# EAGLE design Corn3 (EAGLE 6.1)

## Sheet 1 of 4
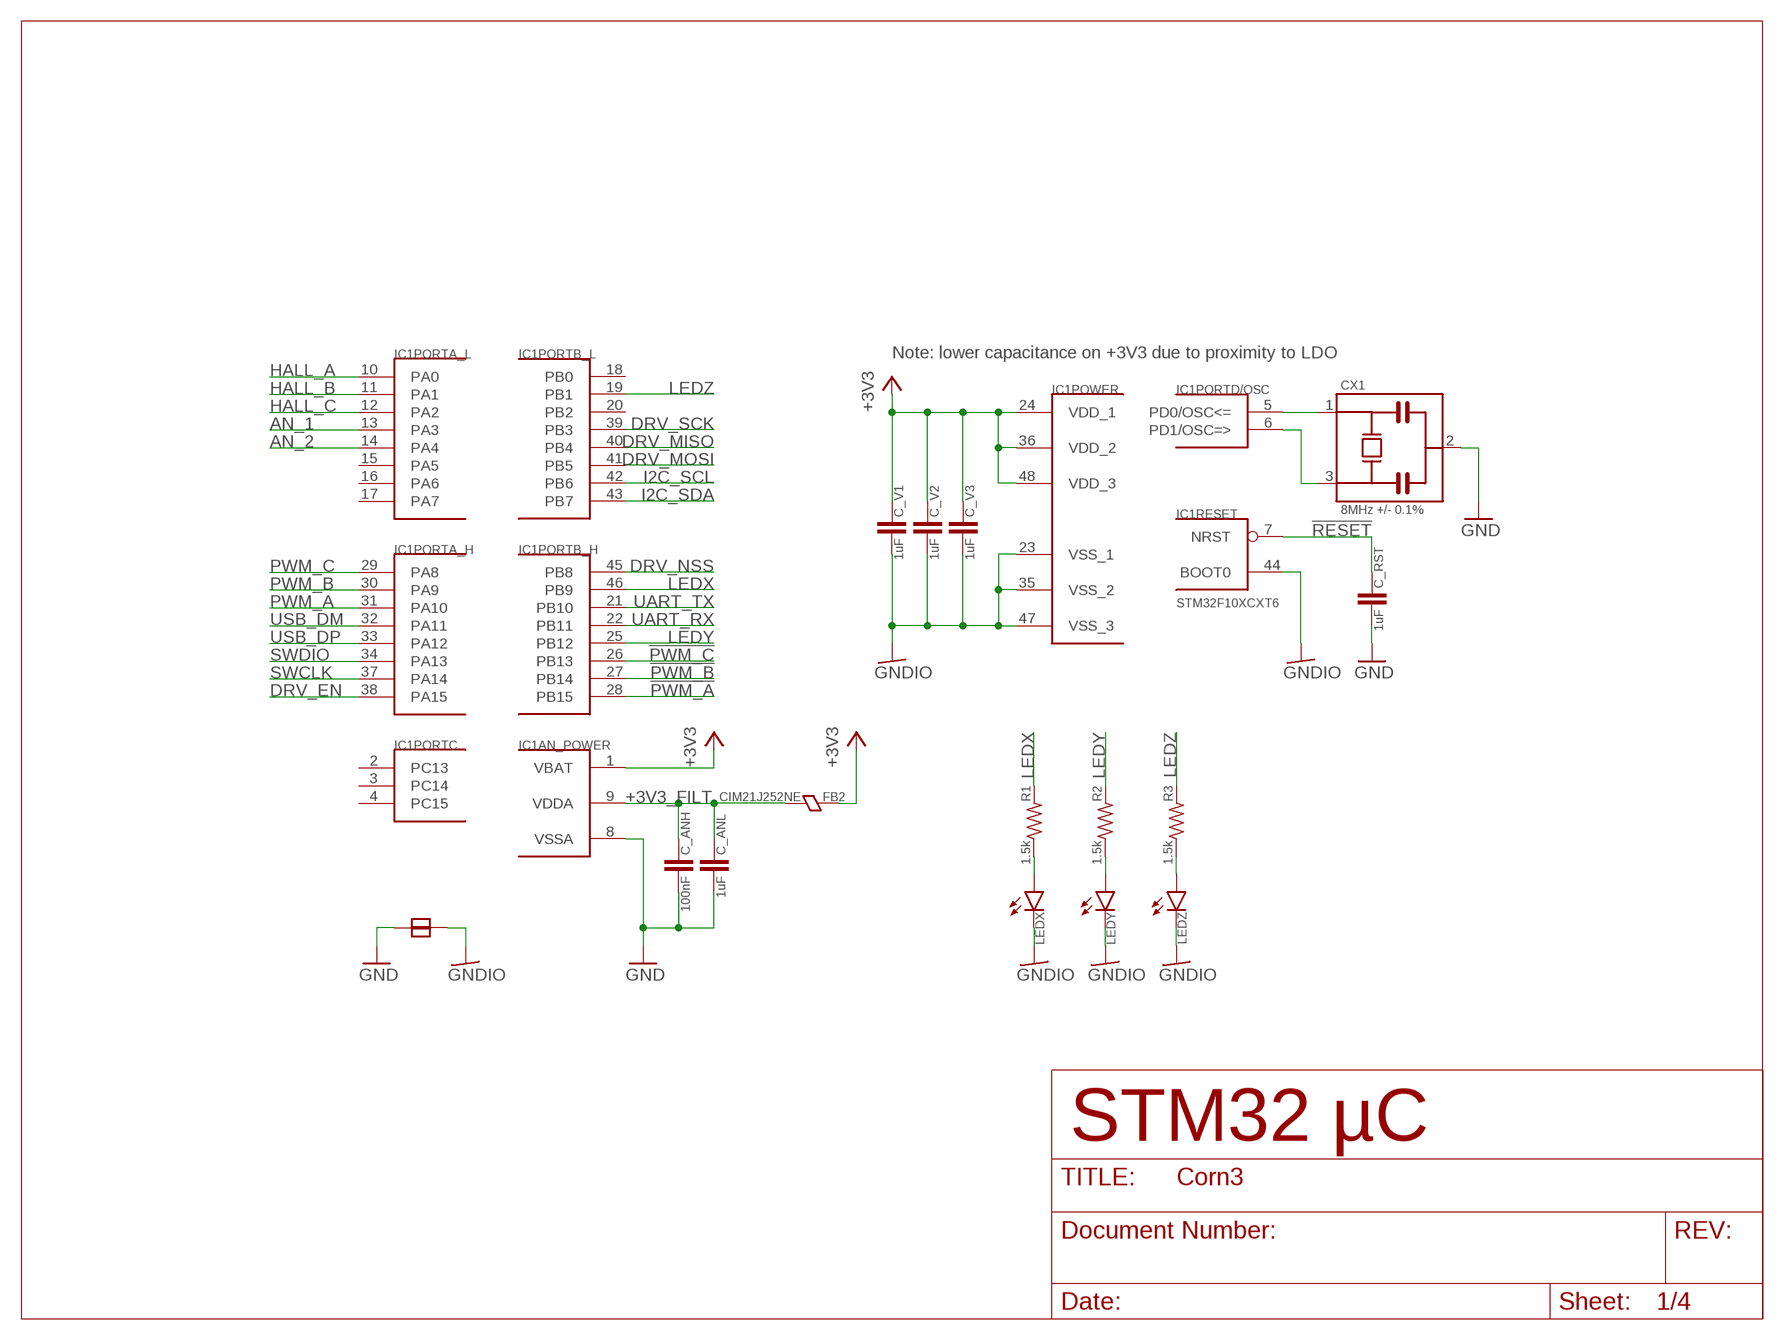
[diagram p0: schematic, sheet 1]

### Parts
C_ANH  100nF  C0603  [0603]
C_ANL  1uF  C0603  [0603]
C_RST  1uF  C0603  [0603]
C_V1  1uF  C0603  [0603]
C_V2  1uF  C0603  [0603]
C_V3  1uF  C0603  [0603]
CX1  8MHz +/- 0.1%  MURATA_CSTCE  [MURATA_CSTCE]
FB2  CIM21J252NE  FERRITE0805  [0805]
IC1  STM32F10XCXT6  [TQFP48]
JUMPER-GND-GNDIO  JUMPER5025  [5025]
LEDX  LED0805  [0805_POL]
LEDY  LED0805  [0805_POL]
LEDZ  LED0805  [0805_POL]
R1  1.5k  R0603  [0603]
R2  1.5k  R0603  [0603]
R3  1.5k  R0603  [0603]

### Nets
!PWM_A: IC1.28(PORTB_H:PB15) ; also sheet 2
!PWM_B: IC1.27(PORTB_H:PB14) ; also sheet 2
!PWM_C: IC1.26(PORTB_H:PB13) ; also sheet 2
!RESET: C_RST.1 IC1.7(RESET:NRST) ; also sheet 3,4
+3V3: C_V1.1 C_V2.1 C_V3.1 FB2.2 IC1.1(AN_POWER:VBAT) IC1.24(POWER:VDD_1) IC1.36(POWER:VDD_2) IC1.48(POWER:VDD_3) ; also sheet 3,4
+3V3_FILT: C_ANH.1 C_ANL.1 FB2.1 IC1.9(AN_POWER:VDDA) ; also sheet 2
AN_1: IC1.13(PORTA_L:PA3) ; also sheet 2
AN_2: IC1.14(PORTA_L:PA4) ; also sheet 2
DRV_EN: IC1.38(PORTA_H:PA15) ; also sheet 2
DRV_MISO: IC1.40(PORTB_L:PB4) ; also sheet 2
DRV_MOSI: IC1.41(PORTB_L:PB5) ; also sheet 2
DRV_NSS: IC1.45(PORTB_H:PB8) ; also sheet 2
DRV_SCK: IC1.39(PORTB_L:PB3) ; also sheet 2
GND: C_ANH.2 C_ANL.2 C_RST.2 CX1.2 IC1.8(AN_POWER:VSSA) JUMPER-GND-GNDIO.1 ; also sheet 2,3,4
GNDIO: C_V1.2 C_V2.2 C_V3.2 IC1.23(POWER:VSS_1) IC1.35(POWER:VSS_2) IC1.44(RESET:BOOT0) IC1.47(POWER:VSS_3) JUMPER-GND-GNDIO.2 LEDX.-(C) LEDY.-(C) LEDZ.-(C)
HALL_A: IC1.10(PORTA_L:PA0) ; also sheet 4
HALL_B: IC1.11(PORTA_L:PA1) ; also sheet 4
HALL_C: IC1.12(PORTA_L:PA2) ; also sheet 4
I2C_SCL: IC1.42(PORTB_L:PB6) ; also sheet 4
I2C_SDA: IC1.43(PORTB_L:PB7) ; also sheet 4
LEDX: IC1.46(PORTB_H:PB9) R1.2
LEDY: IC1.25(PORTB_H:PB12) R2.2
LEDZ: IC1.19(PORTB_L:PB1) R3.2
N$1: CX1.3 IC1.6(PORTD/OSC:PD1/OSC=>)
N$2: CX1.1 IC1.5(PORTD/OSC:PD0/OSC<=)
N$5: LEDX.+(A) R1.1
N$11: LEDZ.+(A) R3.1
N$35: LEDY.+(A) R2.1
PWM_A: IC1.31(PORTA_H:PA10) ; also sheet 2
PWM_B: IC1.30(PORTA_H:PA9) ; also sheet 2
PWM_C: IC1.29(PORTA_H:PA8) ; also sheet 2
SWCLK: IC1.37(PORTA_H:PA14) ; also sheet 4
SWDIO: IC1.34(PORTA_H:PA13) ; also sheet 4
UART_RX: IC1.22(PORTB_H:PB11) ; also sheet 4
UART_TX: IC1.21(PORTB_H:PB10) ; also sheet 4
USB_DM: IC1.32(PORTA_H:PA11) ; also sheet 4
USB_DP: IC1.33(PORTA_H:PA12) ; also sheet 4
Unconnected: IC1.2(PORTC:PC13) IC1.3(PORTC:PC14) IC1.4(PORTC:PC15) IC1.15(PORTA_L:PA5) IC1.16(PORTA_L:PA6) IC1.17(PORTA_L:PA7) IC1.18(PORTB_L:PB0) IC1.20(PORTB_L:PB2)

### Notes on the sheet
- Note: lower capacitance on +3V3 due to proximity to LDO
- STM32 µC

## Sheet 2 of 4
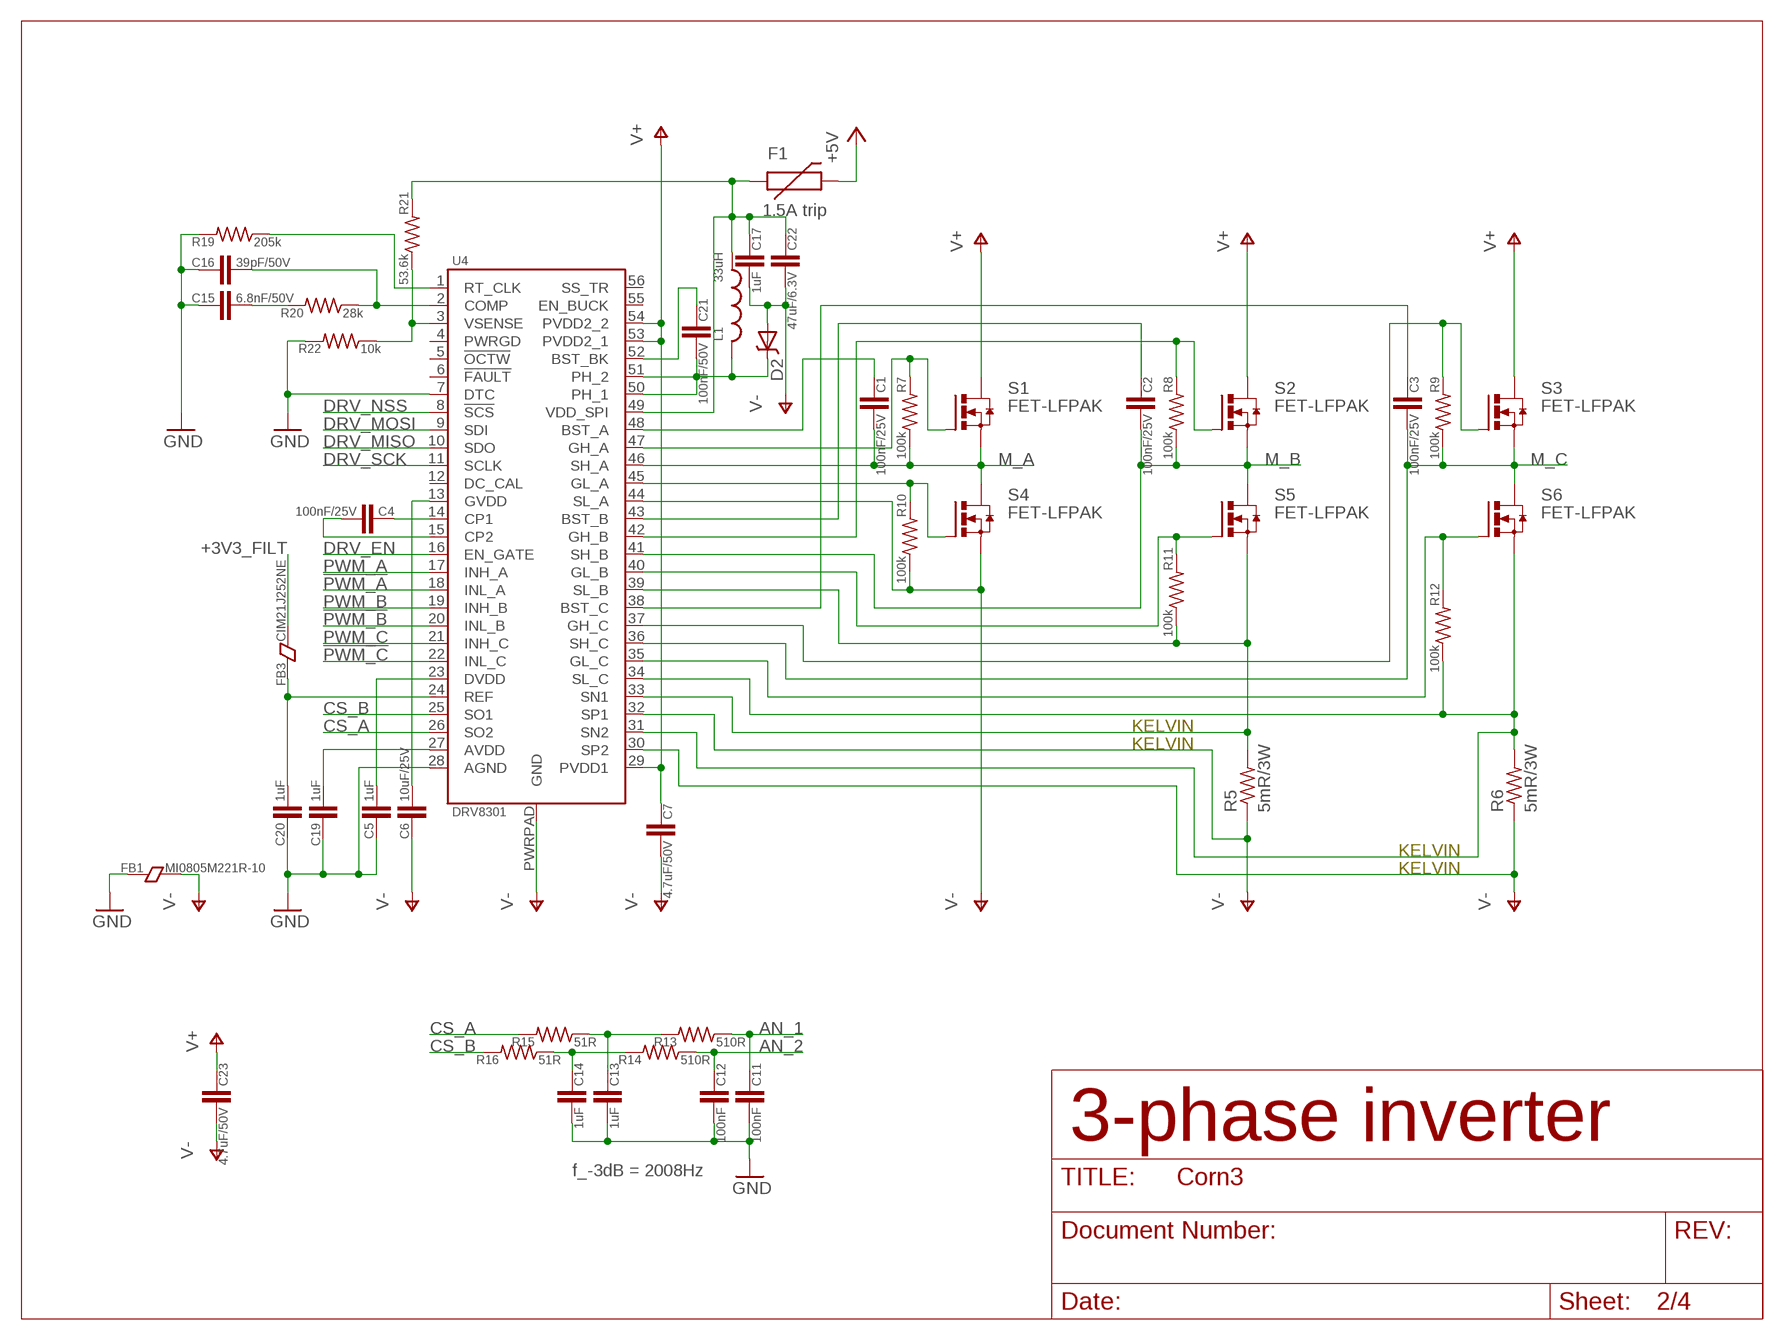
[diagram p1: schematic, sheet 2]

### Parts
C1  100nF/25V  C0603  [0603]
C2  100nF/25V  C0603  [0603]
C3  100nF/25V  C0603  [0603]
C4  100nF/25V  C0603  [0603]
C5  1uF  C0603  [0603]
C6  10uF/25V  C0805  [0805]
C7  4.7uF/50V  C1206  [1206]
C11  100nF  C0603  [0603]
C12  100nF  C0603  [0603]
C13  1uF  C0603  [0603]
C14  1uF  C0603  [0603]
C15  6.8nF/50V  C0603  [0603]
C16  39pF/50V  C0603  [0603]
C17  1uF  C0603  [0603]
C19  1uF  C0603  [0603]
C20  1uF  C0603  [0603]
C21  100nF/50V  C0603  [0603]
C22  47uF/6.3V  C0805  [0805]
C23  4.7uF/50V  C1206  [1206]
D2  DIODE-SCHOTTKY_  [SMA-DIODE]
F1  1.5A trip  PTCSMD  [PTC-1206]
FB1  MI0805M221R-10  FERRITE0805  [0805]
FB3  CIM21J252NE  FERRITE0805  [0805]
L1  33uH  L-US_NR40  [TAIYO-YUDEN_NR40]
R5  5mR/3W  R-US_R2512  [R2512]
R6  5mR/3W  R-US_R2512  [R2512]
R7  100k  R0603  [0603]
R8  100k  R0603  [0603]
R9  100k  R0603  [0603]
R10  100k  R0603  [0603]
R11  100k  R0603  [0603]
R12  100k  R0603  [0603]
R13  510R  R0603  [0603]
R14  510R  R0603  [0603]
R15  51R  R0603  [0603]
R16  51R  R0603  [0603]
R19  205k  R0603  [0603]
R20  28k  R0603  [0603]
R21  53.6k  R0603  [0603]
R22  10k  R0603  [0603]
S1  FET-LFPAK  MOSFET-N56  [SON-5X6]
S2  FET-LFPAK  MOSFET-N56  [SON-5X6]
S3  FET-LFPAK  MOSFET-N56  [SON-5X6]
S4  FET-LFPAK  MOSFET-N56  [SON-5X6]
S5  FET-LFPAK  MOSFET-N56  [SON-5X6]
S6  FET-LFPAK  MOSFET-N56  [SON-5X6]
U4  DRV8301  [HTSSOP-56]

### Nets
!PWM_A: U4.18(INL_A) ; also sheet 1
!PWM_B: U4.20(INL_B) ; also sheet 1
!PWM_C: U4.22(INL_C) ; also sheet 1
+3V3_FILT: FB3.1 ; also sheet 1
+5V: F1.2 ; also sheet 3,4
AN_1: C11.1 R13.1 ; also sheet 1
AN_2: C12.1 R14.1 ; also sheet 1
CS_A: R15.2 U4.26(SO2)
CS_B: R16.2 U4.25(SO1)
DRV_EN: U4.16(EN_GATE) ; also sheet 1
DRV_MISO: U4.10(SDO) ; also sheet 1
DRV_MOSI: U4.9(SDI) ; also sheet 1
DRV_NSS: U4.8(!SCS) ; also sheet 1
DRV_SCK: U4.11(SCLK) ; also sheet 1
GND: C5.1 C11.2 C12.2 C13.2 C14.2 C15.1 C16.1 C19.1 C20.1 FB1.2 R19.2 R22.2 U4.7(DTC) U4.28(AGND) ; also sheet 1,3,4
M_A: C1.2 R7.1 S1.S1(S) S1.S2(S) S1.S3(S) S4.D S4.D_(D) U4.46(SH_A)
M_B: C2.2 R8.1 S2.S1(S) S2.S2(S) S2.S3(S) S5.D S5.D_(D) U4.41(SH_B)
M_C: C3.2 R9.1 S3.S1(S) S3.S2(S) S3.S3(S) S6.D S6.D_(D) U4.36(SH_C)
N$3: R8.2 S2.G U4.42(GH_B)
N$4: R7.2 S1.G U4.47(GH_A)
N$6: R12.2 S6.G U4.35(GL_C)
N$7: R11.2 S5.G U4.40(GL_B)
N$9: R9.2 S3.G U4.37(GH_C)
N$12: C21.1 U4.52(BST_BK)
N$13: C1.1 U4.48(BST_A)
N$14: C2.1 U4.43(BST_B)
N$15: C3.1 U4.38(BST_C)
N$18: R10.2 S4.G U4.45(GL_A)
N$19: C17.1 C22.1 F1.1 L1.1 R21.2 U4.49(VDD_SPI)
N$20: C16.2 R20.1 U4.2(COMP)
N$21: C14.1 R14.2 R16.1
N$22: C13.1 R13.2 R15.1
N$23: C15.2 R20.2
N$24: R21.1 R22.1 U4.3(VSENSE)
N$25: C5.2 U4.23(DVDD)
N$26: C6.2 U4.13(GVDD)
N$27: C4.1 U4.14(CP1)
N$28: C4.2 U4.15(CP2)
N$29: C21.2 D2.C L1.2 U4.50(PH_1) U4.51(PH_2)
N$31: C20.2 FB3.2 U4.24(REF)
N$32: C19.2 U4.27(AVDD)
N$33: R19.1 U4.1(RT_CLK)
PWM_A: U4.17(INH_A) ; also sheet 1
PWM_B: U4.19(INH_B) ; also sheet 1
PWM_C: U4.21(INH_C) ; also sheet 1
SL_B: R5.2 R11.1 S5.S1(S) S5.S2(S) S5.S3(S) U4.33(SN1) U4.39(SL_B)
SL_C: R6.2 R12.1 S6.S1(S) S6.S2(S) S6.S3(S) U4.31(SN2) U4.34(SL_C)
V+: C7.1 C23.1 S1.D S1.D_(D) S2.D S2.D_(D) S3.D S3.D_(D) U4.29(PVDD1) U4.53(PVDD2_1) U4.54(PVDD2_2)
V-: C6.1 C7.2 C17.2 C22.2 C23.2 D2.A FB1.1 R5.1 R6.1 R10.1 S4.S1(S) S4.S2(S) S4.S3(S) U4.30(SP2) U4.32(SP1) U4.44(SL_A) U4.PWRPAD(GND)
Unconnected: U4.4(PWRGD) U4.5(!OCTW) U4.6(!FAULT) U4.12(DC_CAL) U4.55(EN_BUCK) U4.56(SS_TR)

### Notes on the sheet
- KELVIN
- KELVIN
- KELVIN
- KELVIN
- 3-phase inverter
- f_-3dB = 2008Hz

## Sheet 3 of 4
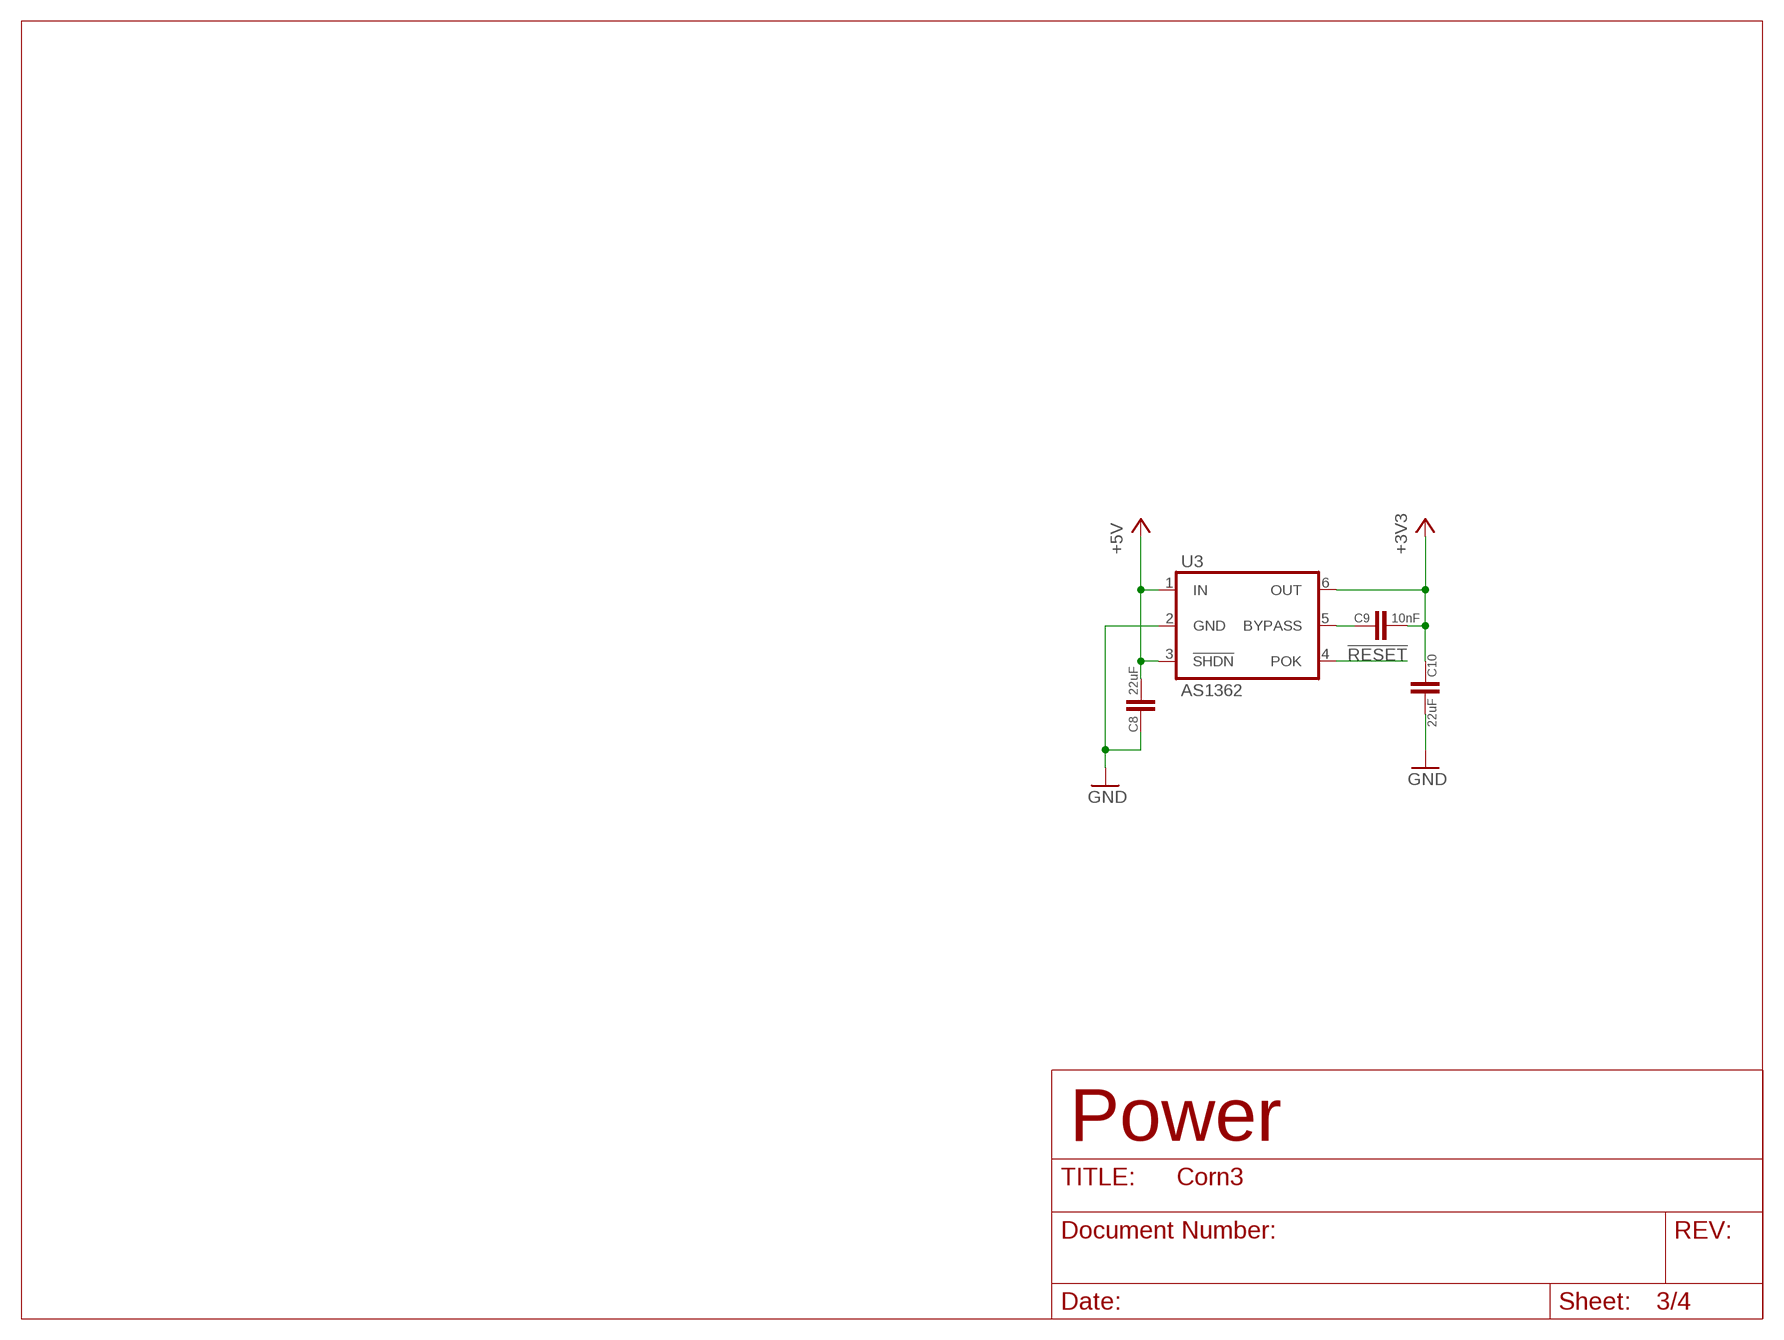
[diagram p2: schematic, sheet 3]

### Parts
C8  22uF  C0805  [0805]
C9  10nF  C0603  [0603]
C10  22uF  C0805  [0805]
U3  AS1362  [SOT23-6]

### Nets
!RESET: U3.4(POK) ; also sheet 1,4
+3V3: C9.2 C10.1 U3.6(OUT) ; also sheet 1,4
+5V: C8.2 U3.1(IN) U3.3(!SHDN) ; also sheet 2,4
GND: C8.1 C10.2 U3.2(GND) ; also sheet 1,2,4
N$8: C9.1 U3.5(BYPASS)

### Notes on the sheet
- Power

## Sheet 4 of 4
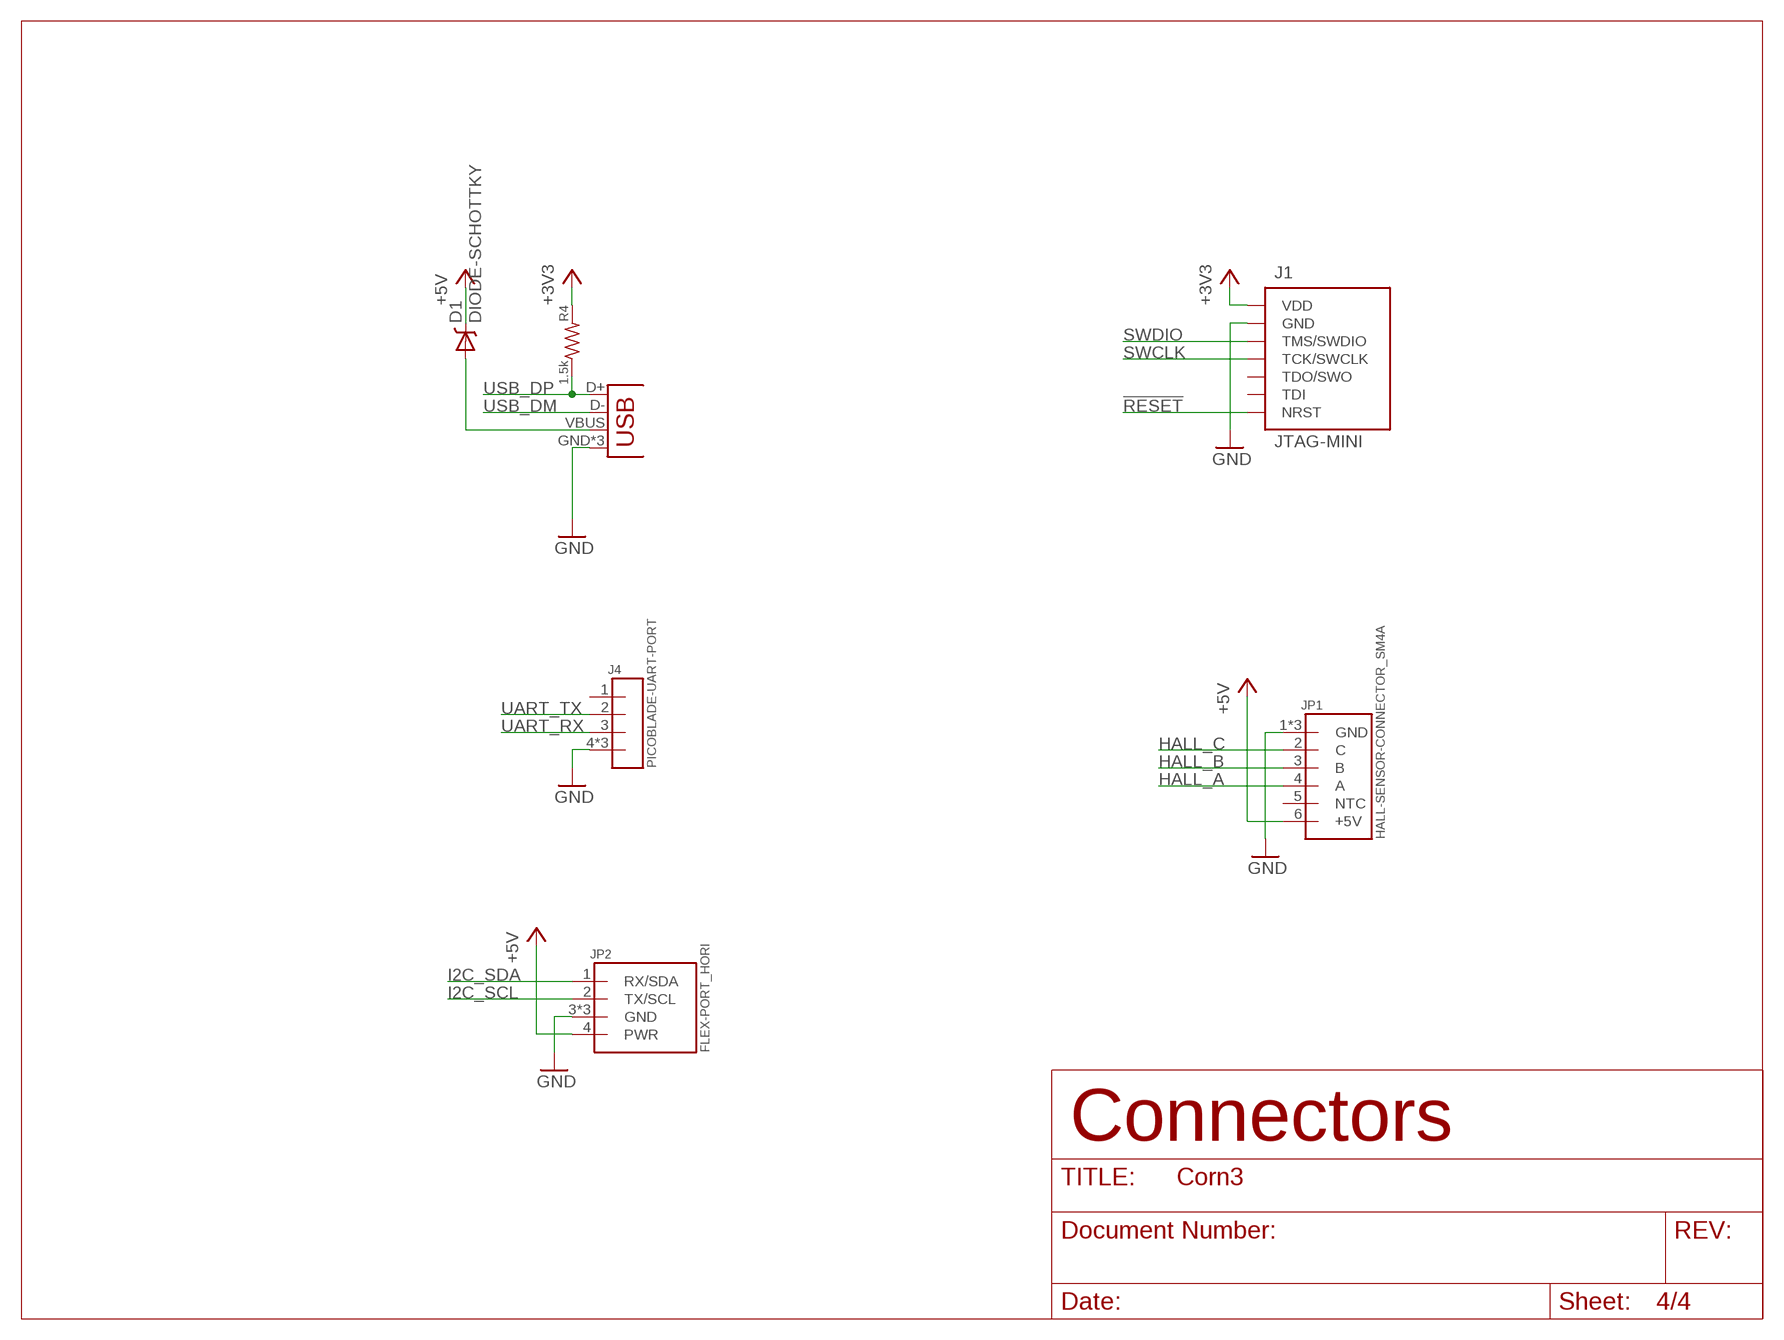
[diagram p3: schematic, sheet 4]

### Parts
D1  DIODE-SCHOTTKY  [SOD-523]
J1  JTAG-MINI  [JTAG-MINI]
J4  PICOBLADE-UART-PORT  [PICOBLADE-04-SMD-RA]
JP1  HALL-SENSOR-CONNECTOR_SM4A  [JST_S6B-ZR-SM4A]
JP2  FLEX-PORT_HORI  [JST_SM04B-SRSS]
JP3  USB-MICROB  [USB-MICROB]
R4  1.5k  R0603  [0603]

### Nets
!RESET: J1.NRST ; also sheet 1,3
+3V3: J1.VDD R4.2 ; also sheet 1,3
+5V: D1.C JP1.6(+5V) JP2.4(PWR) ; also sheet 2,3
GND: J1.GND1(GND) J1.GND2(GND) J1.GND3(GND) J1.GND4(GND) J4.4 J4.TAB1 J4.TAB2 JP1.1(GND) JP1.TAB1(GND) JP1.TAB2(GND) JP2.3(GND) JP2.TAB1(GND) JP2.TAB2(GND) JP3.GND JP3.MT1(GND) JP3.MT2(GND) ; also sheet 1,2,3
HALL_A: JP1.4(A) ; also sheet 1
HALL_B: JP1.3(B) ; also sheet 1
HALL_C: JP1.2(C) ; also sheet 1
I2C_SCL: JP2.2(TX/SCL) ; also sheet 1
I2C_SDA: JP2.1(RX/SDA) ; also sheet 1
N$10: D1.A JP3.VBUS
SWCLK: J1.TCK(TCK/SWCLK) ; also sheet 1
SWDIO: J1.TMS(TMS/SWDIO) ; also sheet 1
UART_RX: J4.3 ; also sheet 1
UART_TX: J4.2 ; also sheet 1
USB_DM: JP3.D- ; also sheet 1
USB_DP: JP3.D+ R4.1 ; also sheet 1
Unconnected: J1.TDI J1.TDO(TDO/SWO) J4.1 JP1.5(NTC)

### Notes on the sheet
- Connectors

## Library data of the parts
C1-C17 C19-C23 C_ANH C_ANL C_RST C_V1-C_V3 = dan-rcl:C
CX1 = Xo-Resonator:MURATA_CSTCE
D1 D2 = SparkFun-DiscreteSemi:DIODE-SCHOTTKY: Commonly MBRA140.
F1 = SparkFun-PowerIC:PTC: Resettable Fuse PTC Resettable Fuse. Spark Fun Electronics SKU : COM-08357; PROD_ID: RES-11150
FB1-FB3 = dan-rcl:FERRITE: Ferrite Bead
IC1 = stm32:STM32F10XCXT6: ST STM32F101/103 48pin LQFP
J1 = Xo-Connector:JTAG
J4 = Xo-Connector:PICOBLADE-UART-PORT
JP1 = Xo-Connector:HALL-SENSOR-CONNECTOR: Receptacle for "standard" R/C car hall sensor and 10k thermistor cable using a 6-position 1.5 mm pitch JST ZH housing.
JP2 = Xo-Connector:FLEX-PORT: Dual purpose UART/I2C board connector compatible with OpenPilot Main Port and Flexi Port. Must use crossover cable for UART connections.
JP3 = SparkFun-Connectors:USB: USB Connectors USB-B-PTH is fully proven SKU : PRT-00139/CONN-08278 USB-miniB is fully proven SKU : PRT-00587 USB-A-PCB is untested. USB-A-H is throughly reviewed, but untested. Spark Fun Electronics SKU : PRT-00437 USB-B-SMT is throughly reviewed, but untested. Needs silkscreen touching up. USB-A-S has not been used/tested USB-MB-H has not been used/tested USB-MICROB has been used. CONN-09505; PROD_ID: CONN-09505
JUMPER-GND-GNDIO = Xo-Jumper:JUMPER
L1 = Xo-RCL:L-US
LEDX LEDY LEDZ = dan-led:LED: LED
R1-R4 R7-R16 R19-R22 = dan-rcl:R
R5 R6 = rcl:R-US_: RESISTOR, American symbol
S1-S6 = Xo-PowerIC:MOSFET-N: Power NMOSFETs in: - D2PAK-7 - 5mm x 6mm (Power56/PQFN 5x6)
U3 = Xo-VReg:AS1362: AMS AS1361/AS1362
U4 = Xo-Driver:DRV8301

## Board
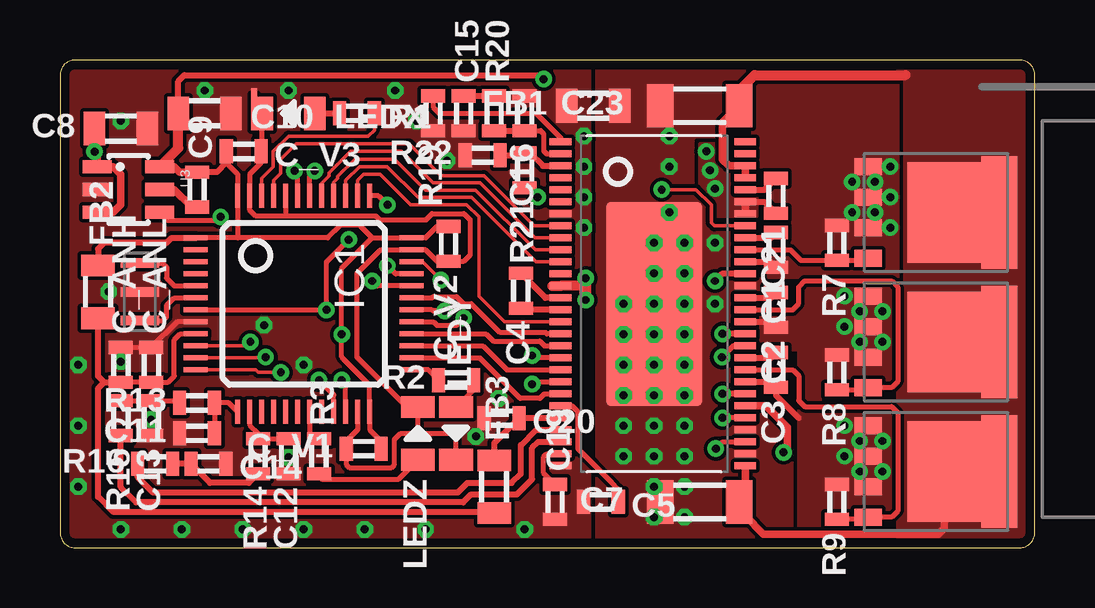
[diagram p4: board, top side]
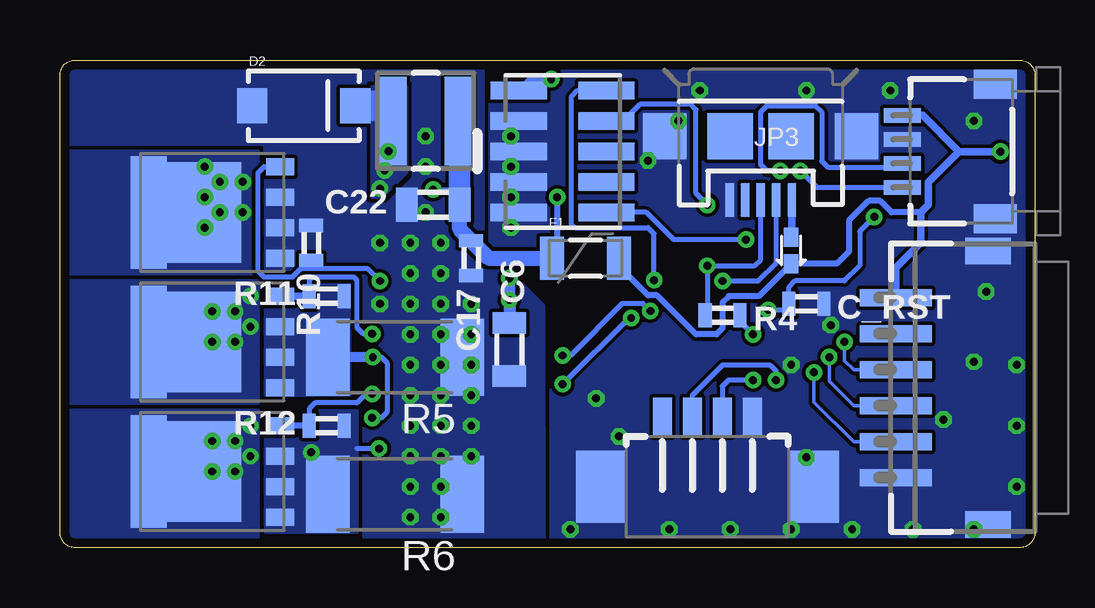
[diagram p5: board, bottom side, seen from below]

Size 40.64 x 20.32 mm. Coordinates in mm from the lower left corner, seen from the top.
Outline: 0,19.68 0,0.64 arc90 0.64,0 40.01,0 arc90 40.64,0.64 40.64,19.68 arc90 40.01,20.32 0.64,20.32 arc90 0,19.68
Copper layers (1*16): Top 0.0356mm / dielectric 1.5011mm / Bottom 0.0356mm
Design rules: minimum track width 6mil, minimum drill 13mil, track to track 6mil, track to pad 6mil, pad to pad 6mil, via to via 6mil, smd to smd 0mil, copper to edge 15mil, drill to drill 18mil, minimum pad ring 7mil, minimum via ring 7mil, stop-mask expansion 4mil, vias tented up to drill 16mil, thermal gap 10mil

### Footprints (pad centres in the part's own frame; a part is rotated, then mirrored left to right if it is on the bottom)
0603 = smd 0.55 x 1: 1 -0.725,0; 2 0.725,0
0805 = smd 0.9 x 1.4: 1 -1.1,0; 2 1.1,0
1206 = smd 1.1 x 1.8: 1 -1.65,0; 2 1.65,0
MURATA_CSTCE = smd 0.4 x 1.6: 1 -1.2,0; 2 0,0; 3 1.2,0
SOD-523 = smd 0.8 x 0.6: A -0.55,0; C 0.55,0
SMA-DIODE = smd 1.27 x 1.47: A -2.15,0; C 2.15,0
PTC-1206 = smd 1 x 1.8: 1 -1.4,0; 2 1.4,0
TQFP48 = smd 0.2 x 1: 1 -2.75,-4.5; 2 -2.25,-4.5; 3 -1.75,-4.5; 4 -1.25,-4.5; 5 -0.75,-4.5; 6 -0.25,-4.5; 7 0.25,-4.5; 8 0.75,-4.5; 9 1.25,-4.5; 10 1.75,-4.5; 11 2.25,-4.5; 12 2.75,-4.5; 25 2.75,4.5; 26 2.25,4.5; 27 1.75,4.5; 28 1.25,4.5; 29 0.75,4.5; 30 0.25,4.5; 31 -0.25,4.5; 32 -0.75,4.5; 33 -1.25,4.5; 34 -1.75,4.5; 35 -2.25,4.5; 36 -2.75,4.5 | smd 1 x 0.2: 13 4.5,-2.75; 14 4.5,-2.25; 15 4.5,-1.75; 16 4.5,-1.25; 17 4.5,-0.75; 18 4.5,-0.25; 19 4.5,0.25; 20 4.5,0.75; 21 4.5,1.25; 22 4.5,1.75; 23 4.5,2.25; 24 4.5,2.75; 37 -4.5,2.75; 38 -4.5,2.25; 39 -4.5,1.75; 40 -4.5,1.25; 41 -4.5,0.75; 42 -4.5,0.25; 43 -4.5,-0.25; 44 -4.5,-0.75; 45 -4.5,-1.25; 46 -4.5,-1.75; 47 -4.5,-2.25; 48 -4.5,-2.75
JTAG-MINI = smd 0.737 x 2.337: GND1 -1.27,-1.829; GND2 0,-1.829; GND3 1.27,-1.829; GND4 2.54,-1.829; NRST 2.54,1.829; TCK -1.27,1.829; TDI 1.27,1.829; TDO 0,1.829; TMS -2.54,1.829; VDD -2.54,-1.829
PICOBLADE-04-SMD-RA = smd 0.8 x 1.6: 1 -1.875,2.9; 2 -0.625,2.9; 3 0.625,2.9; 4 1.875,2.9 | smd 2.1 x 3: TAB1 4.425,0; TAB2 -4.425,0
JST_S6B-ZR-SM4A = smd 0.7 x 3: 1 3.75,-5.8; 2 2.25,-5.8; 3 0.75,-5.8; 4 -0.75,-5.8; 5 -2.25,-5.8; 6 -3.75,-5.8 | smd 1.1 x 1.9: TAB1 -5.7,-1.95; TAB2 5.7,-1.95
JST_SM04B-SRSS = smd 0.6 x 1.55: 1 1.5,-4.575; 2 0.5,-4.575; 3 -0.5,-4.575; 4 -1.5,-4.575 | smd 1.2 x 1.8: TAB1 -2.8,-0.7; TAB2 2.8,-0.7
USB-MICROB = smd 0.35 x 1.4: D+ 0,2.65; D- -0.65,2.65; GND 1.3,2.65; ID 0.65,2.65; VBUS -1.3,2.65 | smd 1.8 x 1.9: MT1 -4,0; MT2 4,0 | smd 1.9 x 1.9: P$1 -1.27,0; P$2 1.27,0
5025 = smd 0.25 x 0.25: 1 -0.125,0; 2 0.125,0
TAIYO-YUDEN_NR40 = smd 1.2 x 3.7: 1 -1.4,0; 2 1.4,0
0805_POL = smd 0.9 x 1.4: + 1.1,0; - -1.1,0
R2512 = smd 1.8 x 3.2: 1 -2.8,0; 2 2.8,0
SON-5X6 = smd 3.1 x 4.2: D -0.35,0 | smd 1.5 x 4.7: D_ -2.65,0 | smd 1.15 x 0.7: G 2.825,1.905; S1 2.825,-1.905; S2 2.825,-0.635; S3 2.825,0.635
SOT23-6 = smd 0.55 x 1.2: 1 -0.95,-1.3; 2 0,-1.3; 3 0.95,-1.3; 4 0.95,1.3; 5 0,1.3; 6 -0.95,1.3
HTSSOP-56 = smd 0.285 x 0.9: 1 -6.75,-3.9; 2 -6.25,-3.9; 3 -5.75,-3.9; 4 -5.25,-3.9; 5 -4.75,-3.9; 6 -4.25,-3.9; 7 -3.75,-3.9; 8 -3.25,-3.9; 9 -2.75,-3.9; 10 -2.25,-3.9; 11 -1.75,-3.9; 12 -1.25,-3.9; 13 -0.75,-3.9; 14 -0.25,-3.9; 15 0.25,-3.9; 16 0.75,-3.9; 17 1.25,-3.9; 18 1.75,-3.9; 19 2.25,-3.9; 20 2.75,-3.9; 21 3.25,-3.9; 22 3.75,-3.9; 23 4.25,-3.9; 24 4.75,-3.9; 25 5.25,-3.9; 26 5.75,-3.9; 27 6.25,-3.9; 28 6.75,-3.9; 29 6.75,3.8; 30 6.25,3.8; 31 5.75,3.8; 32 5.25,3.8; 33 4.75,3.8; 34 4.25,3.8; 35 3.75,3.8; 36 3.25,3.8; 37 2.75,3.8; 38 2.25,3.8; 39 1.75,3.8; 40 1.25,3.8; 41 0.75,3.8; 42 0.25,3.8; 43 -0.25,3.8; 44 -0.75,3.8; 45 -1.25,3.8; 46 -1.75,3.8; 47 -2.25,3.8; 48 -2.75,3.8; 49 -3.25,3.8; 50 -3.75,3.8; 51 -4.25,3.8; 52 -4.75,3.8; 53 -5.25,3.8; 54 -5.75,3.8; 55 -6.25,3.8; 56 -6.75,3.8 | smd 8.5 x 4: PWRPAD 0,0

### Placement (x,y rotation side)
C1  29.84,12.41 270 top
C2  29.84,9.91 270 top
C3  29.84,7.41 270 top
C4  19.21,10.71 270 top
C5  22.54,1.91 0 top
C6  21.91,8.26 90 bottom
C7  26.67,1.91 180 top
C8  2.54,17.46 180 top
C9  5.71,14.92 90 top
C10  6.03,18.1 0 top
C11  5.71,4.76 180 top
C12  9.53,3.81 270 top
C13  3.81,5.4 270 top
C14  6.19,3.49 0 top
C15  16.83,18.1 90 top
C16  19.37,18.1 270 top
C17  23.5,12.06 270 bottom
C19  20.64,1.91 90 top
C20  18.41,5.4 0 top
C21  29.84,14.66 270 top
C22  25.08,14.29 180 bottom
C23  26.67,18.41 180 top
C_ANH  2.54,7.62 90 top
C_ANL  3.81,7.62 90 top
C_RST  9.53,10.16 0 bottom
C_V1  12.66,4.13 180 top
C_V2  16.19,12.66 270 top
C_V3  7.66,16.51 0 top
CX1  3.33,10.66 270 top
D1  10.16,12.38 270 bottom
D2  30.48,18.41 0 bottom
F1  18.73,12.06 0 bottom
FB1  22.23,18.41 180 top
FB2  1.59,10.66 90 top
FB3  18.1,2.54 90 top
IC1  10.16,10.16 270 top
J1  19.68,16.51 270 bottom
J4  13.65,2.54 0 bottom
JP1  0,6.67 270 bottom
JP2  0.95,16.51 270 bottom
JP3  11.43,17.14 180 bottom
JUMPER-GND-GNDIO  8.1,18.89 270 top
L1  25.4,17.78 180 bottom
LEDX  9.53,18.1 0 top
LEDY  16.51,4.76 90 top
LEDZ  14.92,4.76 270 top
R1  12.38,18.1 0 top
R2  16.51,6.99 180 top
R3  10.79,3.81 90 top
R4  13.02,9.68 0 bottom
R5  26.67,7.94 180 bottom
R6  26.67,2.22 180 bottom
R7  32.38,12.7 270 top
R8  32.38,7.3 270 top
R9  32.38,1.91 270 top
R10  30.16,12.7 270 bottom
R11  29.53,10.48 180 bottom
R12  29.53,5.08 180 bottom
R13  5.71,6.03 180 top
R14  8.26,3.81 270 top
R15  2.54,5.4 270 top
R16  3.97,3.49 180 top
R19  15.56,18.1 270 top
R20  18.1,18.1 90 top
R21  19.37,15.72 270 top
R22  17.62,16.35 180 top
S1  36.51,13.97 180 top
S2  36.51,8.57 180 top
S3  36.51,3.17 180 top
S4  34.29,13.97 0 bottom
S5  34.29,8.57 0 bottom
S6  34.29,3.17 0 bottom
U3  2.86,14.92 270 top
U4  24.77,10.16 270 top

### Tracks (layer width: path | path; a pad name or v marks a point on that pad's centre or on a via)
!PWM_A
  Top 0.203: IC1.28 17.76,8.91 18.07,8.6 20,8.6 20.2,8.41 U4.18
!PWM_B
  Top 0.203: IC1.27 17.62,8.41 18.62,7.41 U4.20
!PWM_C
  Top 0.203: IC1.26 17.49,7.91 19.18,6.22 20,6.22 20.2,6.41 U4.22
!RESET  (via drill 0.33)
  Top 0.203: IC1.7 v11.11,9.91 11.11,11.91 v12.04,12.83 | U3.4 4.48,13.65 6.57,13.65 v6.7,13.78
  Bottom 0.203: v11.11,9.91 10.32,9.91 C_RST.1 10.25,10.86 10,11.11 7.94,11.11 7.3,11.75 7.3,13.18 v6.7,13.78 | v12.04,12.83 15.06,12.83 16.19,13.97 J1.NRST
+3V3  (via drill 0.33)
  Top 0.203: C_V2.1 15.71,13.38 15.24,12.91 IC1.36 13.02,12.91 | C_V3.1 6.93,16.03 7.41,15.56 IC1.48 7.41,12.91 | C_V1.1 13.38,4.45 12.91,4.92 IC1.24 12.91,6.78 11.75,7.94 v11.75,8.89 11.75,11.64 13.02,12.91 | 7.41,12.91 IC1.1 | 7.41,12.91 11.16,12.91 11.7,13.44 12.48,13.44 13.02,12.91
  Top 0.254: FB2.2 1.59,12.45 1.84,12.7 4.45,12.7 4.66,12.91 IC1.1 | C_V3.1 6.79,16.36 | 6.93,16.03 6.55,15.65 5.08,15.65 | C10.1 4.93,19.43 5.19,19.68 20,19.68 v20.16,19.53
  Top 0.305: C9.2 5.08,15.65 4.99,15.65 4.76,15.87 U3.6
  Top 0.406: U3.6 4.93,16.65 C10.1
  Bottom 0.203: v11.75,8.89 12.29,9.44 R4.2
  Bottom 0.254: v20.16,19.53 21.04,19.53 J1.VDD
+3V3_FILT
  Top 0.203: C_ANH.1 C_ANL.1 4.51,6.89 4.76,7.15 4.76,8.66 5.02,8.91 IC1.9
  Top 0.254: 1.84,6.89 1.59,6.64 1.59,2.12 2.22,1.48 18.06,1.48 FB3.1 | 1.84,6.89 C_ANH.1 | 1.84,6.89 1.59,7.15 FB2.1
+5V  (via drill 0.33)
  Top 0.305: U3.3 2.23,13.97 2.54,14.29 2.54,15.56 2.23,15.87 U3.1 1.56,16.38 v1.44,16.5 C8.2
  Bottom 0.254: 4.76,13.97 5.97,13.97 6.45,14.45 6.93,14.45 7.75,13.64 7.75,12.34 8.26,11.83 D1.C 11.52,10.48 12.76,10.48 13.02,10.22 13.02,9.14 13.27,8.89 14.13,8.89 15.75,10.52 16.13,10.52 17.33,11.72 F1.2
  Bottom 0.305: JP2.4 4.67,18.01 3.16,16.5 | JP1.6 5.8,11.66 4.76,12.7 4.76,13.97 4.45,14.29 4.45,15.22 3.16,16.5 | 3.16,16.5 v1.44,16.5
AN_1
  Top 0.203: C11.1 R13.1 7.04,6.03 IC1.13
AN_2
  Top 0.203: C12.1 R14.1 8.26,4.76 7.91,5.11 IC1.14
CS_A
  Top 0.254: R15.2 2.54,2.52 3.17,1.89 16.81,1.89 17.14,2.22 19.05,2.22 19.68,2.86 19.68,4.16 19.94,4.41 U4.26
CS_B
  Top 0.254: R16.2 3.24,2.93 3.88,2.29 16.58,2.29 16.99,2.7 18.83,2.7 19.21,3.08 19.21,4.28 19.84,4.91 U4.25
DRV_EN
  Top 0.152: IC1.38 12.41,15.3 12.66,15.56 13.34,15.56 14.61,14.29 16.95,14.29 17.46,13.78 17.46,10.48 18.53,9.41 U4.16
DRV_MISO
  Top 0.152: U4.10 19.82,12.41 17.33,14.9 15.24,14.9 13.95,16.19 12.3,16.19 11.58,15.48 11.58,15.39 11.41,15.22 IC1.40
DRV_MOSI
  Top 0.152: U4.9 19.79,12.91 17.5,15.2 15.56,15.2 14.25,16.51 12.12,16.51 11.23,15.62 11.23,15.49 10.91,15.18 IC1.41
DRV_NSS
  Top 0.152: IC1.45 8.91,15.3 9.21,15.6 9.21,16.19 9.84,16.83 14.55,16.83 15.88,15.51 17.67,15.51 19.77,13.41 U4.8
DRV_SCK
  Top 0.152: U4.11 19.84,11.91 17.16,14.59 14.92,14.59 13.64,15.88 12.48,15.88 11.91,15.3 IC1.39
GND  (via drill 0.33)
  Top 0.203: C_ANH.2 C_ANL.2 4.88,9.41 IC1.8
  other vias: 19.37,0.76 18.29,6.22 2.54,17.78 16.13,16.13 14.86,17.78 6.03,19.05 9.53,19.05 21.84,17.14 21.84,15.88 21.84,14.61 21.84,13.34 15.24,0.76 12.7,0.76 7.62,0.76 5.08,0.76 0.76,2.54 0.76,5.08 0.76,7.62 10.16,7.62 8.51,9.27 2.54,7.75 2.03,10.67 13.97,19.05 2.54,0.76 10.16,0.76 9.53,3.76 3.81,5.33 17.34,4.64
  pour Top (rank 3, no thermals): 0,20.32 22.07,20.32 22.07,0 0,0
  pour Bottom (no thermals): 0,20.32 22.71,20.32 22.71,12.76 20.17,10.22 20.17,0 0,0
GNDIO
  Top 0.203: IC1.23 12.41,4.92 11.94,4.45 C_V1.2 11.94,3.46 12.06,3.33 13.82,3.33 13.95,3.46 13.95,4.51 14.2,4.76 14.92,4.76 | IC1.44 9.41,13.81 | 9.41,13.81 8.16,13.81 7.91,14.06 IC1.47 7.91,15.56 8.38,16.03 C_V3.2 8.43,16.55 LEDX.- 8.1,18.43 JUMPER-GND-GNDIO.2 | LEDY.- 16.51,4.51 16.26,4.76 14.92,4.76 | 14.92,4.76 LEDZ.- 14.46,5.86 12.38,7.94 12.38,11.43 13.36,12.41 IC1.35 15.24,12.41 15.71,11.94 C_V2.2 16.84,11.94 17.09,12.19 17.09,13.66 16.84,13.92 15.51,13.92 15.24,13.65 13.34,13.65 13.18,13.81 9.41,13.81
HALL_A  (via drill 0.33)
  Top 0.152: IC1.10 7.78,8.41 v7.94,8.57
  Bottom 0.152: v7.94,8.57 7.94,7.8 7.56,7.42 JP1.4
HALL_B  (via drill 0.33)
  Top 0.152: IC1.11 8.54,7.91 v8.57,7.94
  Bottom 0.152: v8.57,7.94 8.57,6.93 7.56,5.92 JP1.3
HALL_C  (via drill 0.33)
  Top 0.152: IC1.12 7.62,7.41 7.83,7.41 8.15,7.41 8.26,7.3 v9.21,7.3
  Bottom 0.152: v9.21,7.3 9.21,6.07 7.56,4.42 JP1.2
I2C_SCL  (via drill 0.33)
  Top 0.203: IC1.42 10.41,15.49 v10.62,15.7
  Bottom 0.203: JP2.2 5.9,16.01 6.05,15.86 8.64,15.86 8.89,16.11 8.89,18.16 9.14,18.41 11.18,18.41 11.43,18.16 11.43,15.95 11.18,15.7 v10.62,15.7
I2C_SDA  (via drill 0.33)
  Top 0.203: IC1.43 9.91,15.57 v9.78,15.7
  Bottom 0.203: v9.78,15.7 9.09,15.01 JP2.1
LEDX
  Top 0.152: R1.2 13.11,17.4 12.85,17.14 9.53,17.14 8.89,16.51 8.89,15.87 8.41,15.39 IC1.46
LEDY
  Top 0.203: R2.2 15.36,7.41 IC1.25
LEDZ
  Top 0.203: IC1.19 10.41,4.54 R3.2
M_A  (via drill 0.33)
  Top 0.254: U4.46 29.62,11.91 C1.2
  other vias: 34.61,14.61 33.02,13.97 33.97,13.97 34.61,15.88 34.61,13.34 33.97,15.24 33.02,15.24
  pour Top (rank 2, no thermals): 28.89,19.68 34.92,19.68 34.92,11.26 29.53,11.26 29.53,12.38 28.89,12.38
  pour Bottom (no thermals): 32.38,16.51 40.64,16.51 40.64,11.42 32.38,11.42
M_B  (via drill 0.33)
  Top 0.254: U4.41 29.62,9.41 C2.2
  other vias: 33.34,9.84 32.7,10.48 34.29,9.84 32.7,9.21 33.34,8.57 34.29,8.57
  pour Top (rank 2, no thermals): 30.8,10.96 34.92,10.96 34.92,6.03 30.8,6.03 30.8,8.26 29.21,8.26 29.21,9.84 30.8,9.84
  pour Bottom (no thermals): 32.38,11.12 40.64,11.12 40.64,6.03 32.38,6.03
M_C  (via drill 0.33)
  Top 0.254: U4.36 29.62,6.91 C3.2 29.84,6.35 30.8,5.4
  other vias: 32.7,5.08 33.34,4.45 34.29,4.45 34.29,3.17 33.34,3.17 32.7,3.81
  pour Top (rank 2, no thermals): 30.8,5.72 30.8,0 34.92,0 34.92,5.72
  pour Bottom (no thermals): 32.38,5.72 32.38,0 40.64,0 40.64,5.72
N$1
  Top 0.203: CX1.3 4.29,9.46 4.45,9.62 4.45,10.09 4.76,10.41 IC1.6
N$2
  Top 0.203: CX1.1 4.29,11.86 4.45,11.7 4.45,11.23 4.76,10.91 IC1.5
N$3
  Top 0.203: U4.42 30.54,9.91 30.8,10.16 30.8,10.86 31.05,11.11 34.67,11.11 34.92,10.86 34.92,6.92 34.67,6.67 S2.G 33.6,6.58 R8.2
N$4
  Top 0.203: U4.47 30.45,12.41 30.89,11.97 R7.2 33.6,11.97 S1.G
N$5
  Top 0.254: LEDX.+ R1.1
N$6  (via drill 0.33)
  Top 0.254: U4.35 v27.62,6.41
  Bottom 0.203: v27.62,6.41 27.88,6.41 28.26,6.03 30,6.03 30.25,5.78 R12.2
  Bottom 0.254: R12.2 S6.G
N$7  (via drill 0.33)
  Top 0.254: U4.40 v27.62,8.91
  Bottom 0.203: v27.62,8.91 28,8.91 28.26,9.16 28.26,11.14 28.38,11.27 30.12,11.27 30.25,11.14 R11.2
  Bottom 0.305: S5.G R11.2
N$8
  Top 0.305: C9.1 5.49,14.2 4.76,14.92 U3.5
N$9
  Top 0.203: R9.2 33.6,1.18 S3.G 34.67,1.27 34.92,1.52 34.92,5.62 34.67,5.87 31.05,5.87 30.8,6.13 30.8,7.16 30.54,7.41 U4.37
N$10
  Bottom 0.305: JP3.VBUS 10.13,12.96 D1.A
N$11
  Top 0.203: R3.1 10.79,2.98 10.92,2.86 14.12,2.86 LEDZ.+
N$12
  Top 0.254: U4.52 29.37,14.91 C21.1
N$13
  Top 0.254: U4.48 29.62,12.91 C1.1
N$14
  Top 0.254: U4.43 29.62,10.41 C2.1
N$15
  Top 0.254: U4.38 29.62,7.91 C3.1
N$18  (via drill 0.33)
  Top 0.254: U4.45 27.6,11.41 v27.3,11.11
  Bottom 0.203: S4.G 32.13,15.88 32.38,15.62 32.38,11.53 32.13,11.27 30.96,11.27 30.61,11.63 30.16,11.63 | v27.3,11.11 27.82,11.63 30.16,11.63 | R10.2 30.16,11.63
N$19  (via drill 0.33)
  Top 0.152: U4.49 27.27,13.41 27.15,13.54 27.15,14.29 26.51,14.92 v25.08,14.92
  Top 0.254: v19.91,14.61 19.53,14.99 R21.2
  Bottom 0.152: 24.3,14.92 23.98,15.24
  Bottom 0.203: v25.08,14.92 24.3,14.92
  Bottom 0.254: v19.91,14.61 19.91,12.28 F1.1
  Bottom 0.508: 23.98,13.82 C22.1
  Bottom 0.635: F1.1 22.77,12.06 C17.1 23.98,13.28 C22.1
  Bottom 0.889: C22.1 23.98,15.24 23.98,17.76 L1.1
N$20
  Top 0.203: C16.2 20.03,17.37 20.16,17.25 20.16,16.54 20.29,16.41 U4.2
  Top 0.254: R20.1 C16.2
N$21
  Top 0.254: R14.2 7.87,2.7 6.26,2.7 C14.1 R16.1
N$22
  Top 0.203: R15.1 C13.1 4.9,6.12 R13.2
N$23
  Top 0.254: C15.2 R20.2
N$24
  Top 0.254: R22.1 19.28,16.35 R21.1 19.59,16.44 20.13,15.91 U4.3
N$25
  Top 0.203: C5.2 23.27,2.44 23.01,2.7 21.59,4.12 21.59,5.66 21.34,5.91 U4.23
N$26  (via drill 0.33)
  Top 0.406: 20.52,10.91 U4.13 21.91,10.91 v21.91,11.23
  Top 0.508: v21.91,10.32 v21.91,11.23
  Bottom 0.508: v21.91,11.23 v21.91,10.32 C6.2
N$27
  Top 0.254: U4.14 20.23,10.41 C4.1
N$28
  Top 0.254: U4.15 19.28,9.91 C4.2
N$29  (via drill 0.33)
  Top 0.254: U4.51 29.37,14.41 C21.2
  Top 0.305: U4.51 U4.50
  Bottom 1.27: D2.C 27.52,18.41
  other vias: 27.3,14.96 27.1,15.72 26.94,16.52
  pour Top (no thermals): 29.05,13.81 27.3,13.81 27.3,14.29 26.67,14.92 26.67,16.83 29.05,16.83
  pour Bottom (no thermals): 26.19,19.21 27.62,19.21 27.62,14.61 27.21,14.61 26.19,15.62
N$31
  Top 0.254: U4.24 19.15,5.41 C20.2 18.1,4.36 FB3.2
N$32
  Top 0.203: C19.2 20.16,3.11 20.16,3.78 20.29,3.91 U4.27
N$33
  Top 0.203: R19.1 15.56,18.35 15.81,18.1 19.85,18.1 20.86,17.08 U4.1
N$35
  Top 0.203: LEDY.+ 17.23,6.59 R2.1
PWM_A
  Top 0.203: IC1.31 15.51,10.41 15.56,10.46 16.53,10.46 16.82,10.17 17.14,10.17 18.35,8.96 20.25,8.96 20.3,8.91 U4.17
PWM_B  (via drill 0.33)
  Top 0.203: v16.03,9.86 15.56,9.86 15.51,9.91 IC1.30 | U4.19 19.78,7.91 v19.68,8.01
  Bottom 0.203: v16.03,9.86 16.34,10.17 17.21,10.17 19.37,8.01 v19.68,8.01
PWM_C  (via drill 0.33)
  Top 0.203: IC1.29 15.57,9.41 15.72,9.27 16.52,9.27 v16.83,9.57 | v19.68,6.81 19.78,6.91 U4.21
  Bottom 0.203: v16.83,9.57 16.93,9.57 v19.68,6.81
SL_B  (via drill 0.33)
  Top 0.203: U4.33 v27.62,5.41 | U4.39 28.07,8.41 v27.6,7.94
  Bottom 0.203: v27.62,5.41 27.24,5.41 26.99,5.66 26.99,7.68 27.24,7.94 v27.6,7.94
  Bottom 0.406: v27.6,7.94 R5.2
  pour Bottom (no thermals): 28.57,6.35 28.57,11.11 29.84,11.11 29.84,10.48 32.07,10.48 32.07,6.35
SL_C  (via drill 0.33)
  Top 0.203: v27.34,4.13 27.62,4.41 U4.31
  Top 0.305: U4.34 29.43,5.91 30.32,5.02 30.32,4.13 v30.16,3.97
  Bottom 0.203: v27.34,4.13 28.26,4.13
  pour Bottom (no thermals): 28.26,5.71 28.26,0.64 32.07,0.64 32.07,4.76 29.84,4.76 29.84,5.71
SWCLK  (via drill 0.33)
  Top 0.203: IC1.37 13.28,14.66 v13.65,14.29
  Bottom 0.203: v13.65,14.29 14.13,14.76 14.13,18.26 14.34,18.47 16.46,18.47 17.14,17.78 J1.TCK
SWDIO  (via drill 0.33)
  Top 0.152: 15.08,11.91 IC1.34 15.11,11.91 v15.88,11.15
  Bottom 0.203: v15.88,11.15 15.88,13.08 16.13,13.34 19.19,13.34 19.32,13.46 19.32,18.8 19.06,19.05 J1.TMS
UART_RX  (via drill 0.33)
  Top 0.203: IC1.22 11.91,6.82 v11.75,6.99
  Bottom 0.203: v11.75,6.99 12.77,6.99 13.03,6.73 J4.3
UART_TX  (via drill 0.33)
  Top 0.203: IC1.21 11.41,6.37 v10.79,6.99
  Bottom 0.203: J4.2 14.28,6.35 13.01,7.62 11.05,7.62 10.79,7.37 v10.79,6.99
USB_DM  (via drill 0.33)
  Top 0.203: IC1.32 13.22,10.91 v13.02,11.11
  Bottom 0.203: v13.02,11.11 11.54,11.11 10.78,11.87 JP3.D-
USB_DP  (via drill 0.33)
  Top 0.203: IC1.33 13.99,11.41 v13.65,11.75
  Bottom 0.203: JP3.D+ 11.43,12 11.68,11.75 v13.65,11.75 13.65,9.77 R4.1
V+
  Top 0.305: C23.1 27.62,17.72 27.62,16.16 27.88,15.91 U4.54 U4.53 | S3.D 36.86,0.81 36.61,0.56 29.33,0.56 28.57,1.32 28.57,2.15 | C7.1 28.57,2.15 | 28.57,2.15 28.57,2.54 U4.29
  Top 0.406: C23.1 28.32,19.05 28.95,19.68 35.24,19.68
  pour Top (rank 4, no thermals): 34.92,20.32 40.64,20.32 40.64,0 34.92,0
V-  (via drill 0.33)
  other vias: 26.04,11.43 24.77,11.43 23.5,10.16 24.77,10.16 26.04,10.16 26.04,8.89 24.77,8.89 23.5,8.89 23.5,7.62 24.77,7.62 26.04,7.62 26.04,6.35 24.77,6.35 23.5,6.35 23.5,5.08 24.77,5.08 26.04,5.08 24.77,12.7 26.04,12.7 25.4,13.97 27.3,10.16 25.4,15.88 25.4,17.14 27.3,12.7 26.04,3.81 24.77,3.81 23.5,3.81 26.04,2.54 26.04,1.27 24.77,2.54 24.77,1.27
  pour Bottom (rank 2, no thermals): 23.01,20.32 40.64,20.32 40.64,0 20.47,0 20.49,10.11 23.01,12.64
  pour Top (rank 3, no thermals): 22.38,20.32 34.92,20.32 34.92,0 22.38,0